# Altium schematic sheet ConstController.SchDoc
size A4
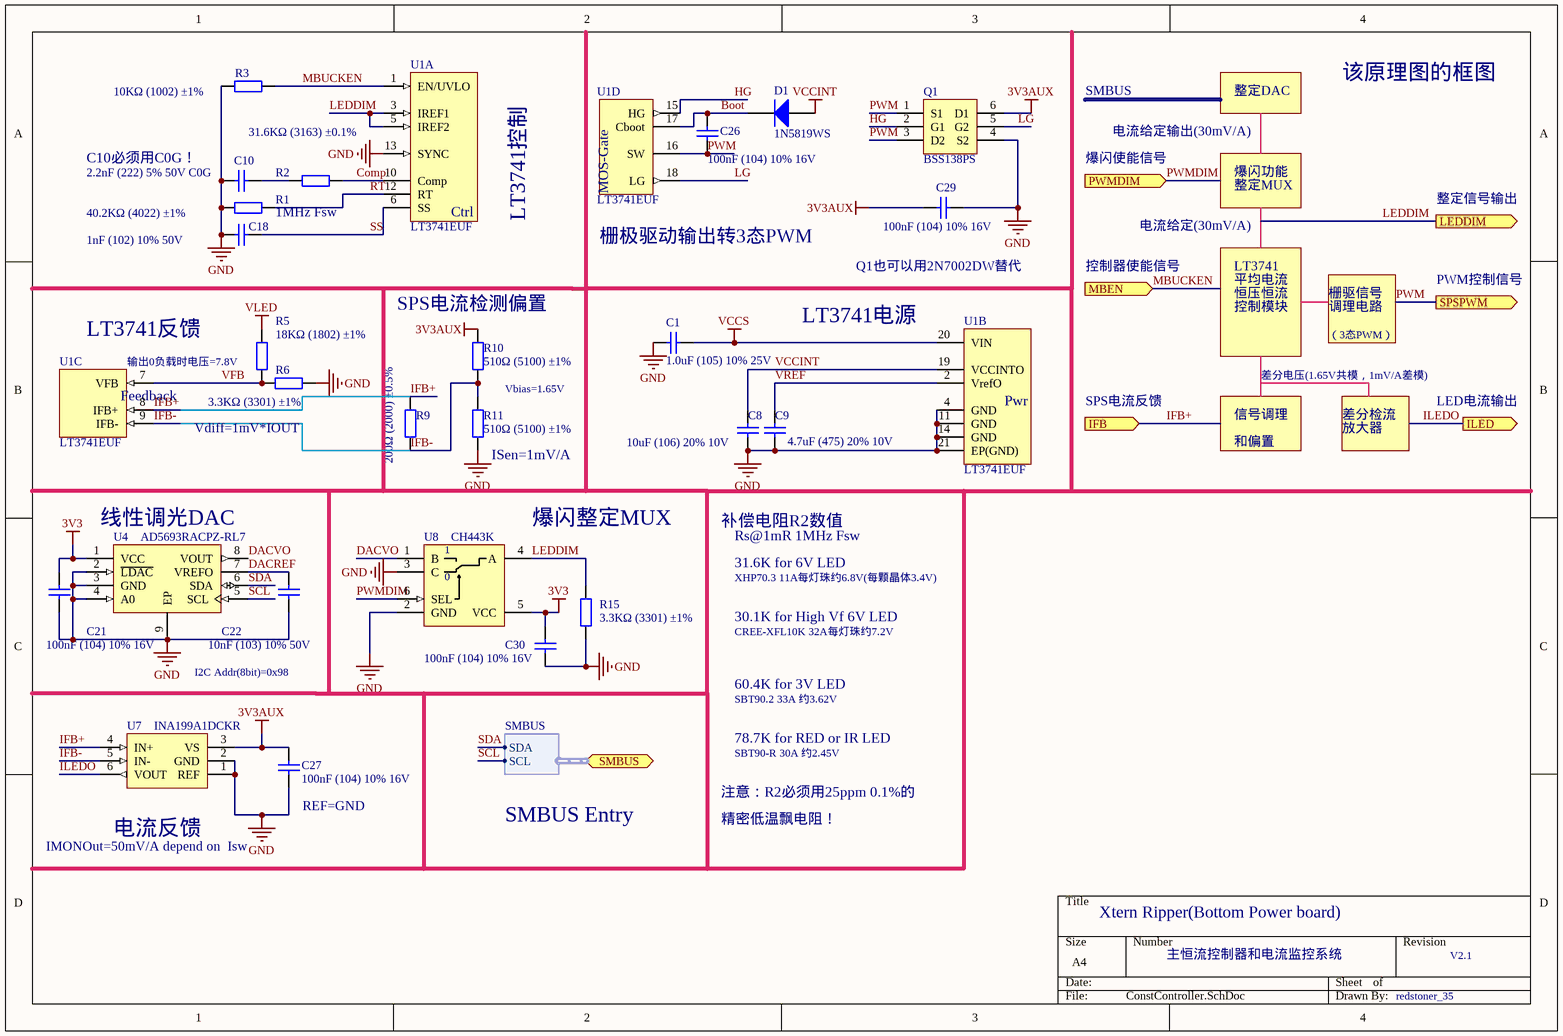
[diagram p0: ConstController.SchDoc]

## Parts
C1  1.0uF (105) 10% 25V  [0402_C]
C8  10uF (106) 20% 10V  [0402_C]
C9  4.7uF (475) 20% 10V  [0402_C]
C10  2.2nF (222) 5% 50V C0G  [0402_C]
C18  1nF (102) 10% 50V  [0402_C]
C21  100nF (104) 10% 16V  [0402_C]
C22  10nF (103) 10% 50V  [0402_C]
C26  100nF (104) 10% 16V  [0402_C]
C27  100nF (104) 10% 16V  [0402_C]
C29  100nF (104) 10% 16V  [0402_C]
C30  100nF (104) 10% 16V  [0402_C]
D1  1N5819WS  [SOD-323]
Q1  BSS138PS  [SC70-6]
R1  40.2KΩ (4022) ±1%  [0402_R]
R2  31.6KΩ (3163) ±0.1%  [0402_R]
R3  10KΩ (1002) ±1%  [0402_R]
R5  18KΩ (1802) ±1%  [0402_R]
R6  3.3KΩ (3301) ±1%  [0402_R]
R9  200Ω (2000) ±0.5%  [0402_R]
R10  510Ω (5100) ±1%  [0402_R]
R11  510Ω (5100) ±1%  [0402_R]
R15  3.3KΩ (3301) ±1%  [0402_R]
U1  LT3741EUF  [UF-05-08-1710A]  (parts A,B,C,D of 4)
U4  AD5693RACPZ-RL7  [LFCSP-8-10]
U7  INA199A1DCKR  [SC70-6]
U8  CH443K  [SC70-6]

## Ports
IFB (in), ILED (out), LEDDIM (out), MBEN (in), PWMDIM (in), SMBUS (harness SMBUS), SPSPWM (out)

## Harnesses
SMBUS: SDA, SCL

## Nets
3V3: C21.2 C30.2 U4.1(VCC) U8.5(VCC)
3V3AUX: C27.1 C29.1 Q1.6(D1) R10.1 U7.3(VS)
GND: C1.1 C8.1 C9.1 C10.2 C18.1 C21.1 C22.1 C27.2 C29.2 C30.1 Q1.4(S2) R1.1 R3.1 R6.2 R11.2 R15.1 U1.4(GND) U1.11(GND) U1.13(SYNC) U1.14(GND) U1.21(EP(GND)) U4.2(~{LDAC}) U4.3(GND) U4.4(A0) U4.9(EP) U7.1(REF) U7.2(GND) U8.2(GND) U8.3(C)
VCCINT: C8.2 D1.1(A) U1.19(VCCINTO)
VCCS: C1.2 U1.20(VIN)
VLED: R5.2
Boot: C26.2 D1.2(K) U1.17(Cboot)
Comp: R2.1 U1.10(Comp)
DACREF: C22.2 U4.7(VREFO)
DACVO: U4.8(VOUT) U8.1(B)
HG: Q1.2(G1) U1.15(HG)
IFB+: R9.2 U1.8(IFB+) U7.4(IN+) ; port IFB
IFB-: R9.1 R10.2 R11.1 U1.9(IFB-) U7.5(IN-)
ILEDO: U7.6(VOUT) ; port ILED
LEDDIM: R15.2 U1.3(IREF1) U1.5(IREF2) U8.4(A) ; port LEDDIM
LG: Q1.5(G2) U1.18(LG)
MBUCKEN: R3.2 U1.1(EN/UVLO) ; port MBEN
PWM: C26.1 Q1.1(S1) Q1.3(D2) U1.16(SW) ; port SPSPWM
PWMDIM: U8.6(SEL) ; port PWMDIM
RT: R1.2 U1.12(RT)
SCL: U4.5(SCL) ; port SMBUS.SCL
SDA: U4.6(SDA) ; port SMBUS.SDA
SS: C18.2 U1.6(SS)
VFB: R5.1 R6.1 U1.7(VFB)
VREF: C9.2 U1.2(VrefO)
NetC10_1: C10.1 R2.2

## Notes on the sheet
- SMBUS
- 整定DAC
- 该原理图的框图
- C10必须用C0G！
- 爆闪使能信号
- 电流给定输出(30mV/A)
- 爆闪功能
- (near R1) 1MHz Fsw
- LT3741控制
- (near U1) 栅极驱动输出转3态PWM
- 电流给定(30mV/A)
- 整定MUX
- 整定信号输出
- (near R10) SPS电流检测偏置
- Q1也可以用2N7002DW替代
- 控制器使能信号
- LT3741
- 平均电流
- 恒压恒流
- 控制模块
- 栅驱信号
- 调理电路
- PWM控制信号
- (near U1) LT3741反馈
- (near U1) 输出0负载时电压=7.8V
- LT3741电源
- 差分电压(1.65V共模，1mV/A差模)
- （3态PWM）
- Vdiff=1mV*IOUT
- Vbias=1.65V
- SPS电流反馈
- 信号调理
- 和偏置
- 差分检流
- 放大器
- LED电流输出
- (near R11) ISen=1mV/A
- (near U4) 线性调光DAC
- (near U8) 爆闪整定MUX
- 补偿电阻R2数值
- 31.6K for 6V LED
- Rs@1mR 1MHz Fsw
- XHP70.3 11A每灯珠约6.8V(每颗晶体3.4V)
- 30.1K for High Vf 6V LED
- CREE-XFL10K 32A每灯珠约7.2V
- I2C Addr(8bit)=0x98
- SBT90.2 33A 约3.62V
- 60.4K for 3V LED
- 78.7K for RED or IR LED
- SBT90-R 30A 约2.45V
- IMONOut=50mV/A depend on  Isw
- (near U7) 电流反馈
- (near C27) REF=GND
- SMBUS Entry
- 注意：R2必须用25ppm 0.1%的
- 精密低温飘电阻！
- Xtern Ripper(Bottom Power board)
- 主恒流控制器和电流监控系统
- V2.1
- redstoner_35
- (in symbol LT3741EUF, part A) Ctrl
- (in symbol LT3741EUF, part B) Pwr
- (in symbol LT3741EUF, part C) Feedback
- (in symbol LT3741EUF, part D) MOS-Gate
- (in symbol NC7SB3157P6X) 0

## Library data of the parts
C1 = 0402 1.0uF (105) 10% 25V: 贴片电容; ComponentLink1Description: 供应商链接; ComponentLink1URL: http://www.szlcsc.com/product/details_53938.html; Package: 0402; Supplier: LC; SuppliersPartNumber: C52923
C8 C9 = 0402 4.7uF (475) 20% 10V: 贴片电容; ComponentLink1Description: 供应商链接; ComponentLink1URL: http://www.szlcsc.com/product/details_24469.html; Package: 0402; Supplier: LC
  C8: SuppliersPartNumber: C??????
  C9: SuppliersPartNumber: C23733
C10 = 0402 2.2nF (222) 10% 50V: 贴片电容; Material: C0G/NP0; ComponentLink1Description: 供应商链接; ComponentLink1URL: http://www.szlcsc.com/product/details_1883.html; Package: 0402; Supplier: LC; SuppliersPartNumber: C?????????
C18 = 0402 1nF (102) 10% 50V: 贴片电容; ComponentLink1Description: 供应商链接; ComponentLink1URL: http://www.szlcsc.com/product/details_1875.html; Package: 0402; Supplier: LC; SuppliersPartNumber: C1523
C21 C26 C27 C29 C30 = 0402 100nF (104) 10% 16V: 贴片电容; ComponentLink1Description: 供应商链接; ComponentLink1URL: http://www.szlcsc.com/product/details_1877.html; Package: 0402; Supplier: LC; SuppliersPartNumber: C1525
C22 = 0402 10nF (103) 10% 50V: 贴片电容; ComponentLink1Description: 供应商链接; ComponentLink1URL: http://www.szlcsc.com/product/details_15869.html; Package: 0402; Supplier: LC; SuppliersPartNumber: C15195
D1 = SOD-323 1N4148WS T4: 二极管; ComponentLink1Description: 供应商链接; ComponentLink1URL: http://www.szlcsc.com/product/details_2485.html; Package: SOD-323; Supplier: LC; SuppliersPartNumber: C?????
Q1 = 2N7002DW: Dual N-Channel MOSFET 60V320mA SOT-363
R1 R2 = 0402 49.9KΩ (4992) 1%: 贴片电阻; ComponentLink1Description: 供应商链接; ComponentLink1URL: http://www.szlcsc.com/product/details_26640.html; Package: 0402; Supplier: LC; SuppliersPartNumber: C??????
R3 = 0402 10KΩ (1002) 1%: 贴片电阻; ComponentLink1Description: 供应商链接; ComponentLink1URL: http://www.szlcsc.com/product/details_26487.html; Package: 0402; Supplier: LC; SuppliersPartNumber: C25744
R5 = 0402 18KΩ (1802) 1%: 贴片电阻; ComponentLink1Description: 供应商链接; ComponentLink1URL: http://www.szlcsc.com/product/details_26505.html; Package: 0402; Supplier: LC; SuppliersPartNumber: C25762
R6 R15 = 0402 3.3KΩ (3301) 1%: 贴片电阻; ComponentLink1Description: 供应商链接; ComponentLink1URL: http://www.szlcsc.com/product/details_26633.html; Package: 0402; Supplier: LC; SuppliersPartNumber: C25890
R9 = 0402 200Ω (2000) 1%: 贴片电阻; ComponentLink1Description: 供应商链接; ComponentLink1URL: http://www.szlcsc.com/product/details_25830.html; Package: 0402; Supplier: LC; SuppliersPartNumber: C????
R10 R11 = 0402 510Ω (5100) 1%: 贴片电阻; ComponentLink1Description: 供应商链接; ComponentLink1URL: http://www.szlcsc.com/product/details_25866.html; Package: 0402; Supplier: LC; SuppliersPartNumber: C25123
U1 = LT3741EUF: Constant Voltage/Current Sync Buck controller(external switch)
U4 = AD5693RACPZ-RL7: 16bit I2C Nano DAC with 2.5V internal Ref in 2x2mm SON
U7 = INA199A2DCKR: 50Khz 50V/V 26V Max High Side Current Op Amp.
U8 = NC7SB3157P6X: Low-Voltage Analog Switch SPDT,1.8-5V Power